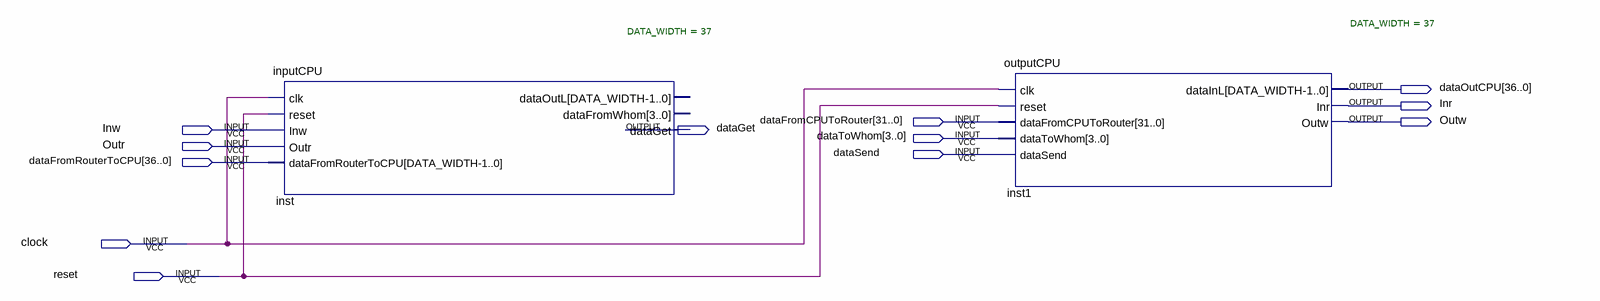
[diagram p0: schematic sheet]
// Quartus schematic LocalCPU.bdf as structural Verilog: 2 symbols, 12 pins
module LocalCPU (
  input  [31:0] dataFromCPUToRouter,
  input  Inw,
  input  [3:0] dataToWhom,
  input  Outr,
  input  dataSend,
  input  [36:0] dataFromRouterToCPU,
  input  clock,
  input  reset,
  output [36:0] dataOutCPU,
  output Inr,
  output Outw,
  output dataGet
);

  inputCPU #(.DATA_WIDTH(37)) inst (
    .clk(clock), .reset(reset), .Inw(Inw), .Outr(Outr), .dataFromRouterToCPU(dataFromRouterToCPU));  // open: dataOutL, dataFromWhom, dataGet
  outputCPU #(.DATA_WIDTH(37)) inst1 (
    .clk(clock), .reset(reset), .dataFromCPUToRouter(dataFromCPUToRouter), .dataToWhom(dataToWhom),
    .dataSend(dataSend), .dataInL(dataOutCPU), .Inr(Inr), .Outw(Outw));
endmodule
